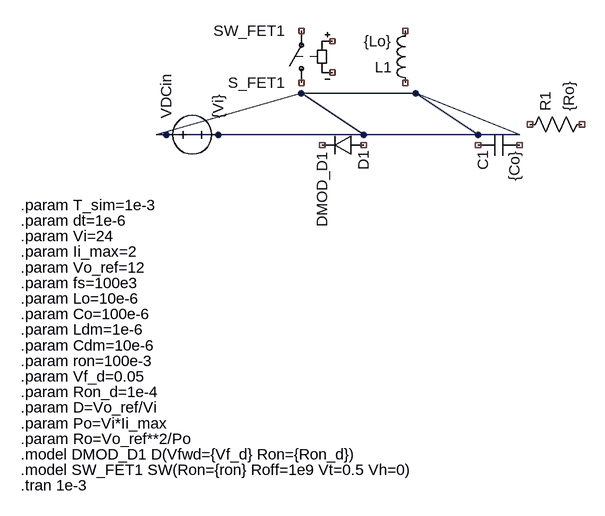
[diagram p0: schematic simple_buck_prb.asc]
simple_buck_prb.asc, the LTspice schematic file:
Version 4
SHEET 1 880 680
WIRE 400 128 576 128
WIRE 400 128 496 192
WIRE 176 192 400 128
WIRE 576 128 672 192
WIRE 576 128 736 192
WIRE 672 192 736 192
WIRE 672 192 176 192
WIRE 672 192 496 192
SYMBOL voltage 176 192 R270
SYMATTR InstName VDCin
SYMATTR Value {Vi}
SYMBOL res 736 192 R270
SYMATTR InstName R1
SYMATTR Value {Ro}
SYMBOL ind 576 128 R180
SYMATTR InstName L1
SYMATTR Value {Lo}
SYMATTR SpiceLine ic=0
SYMBOL cap 672 192 M90
SYMATTR InstName C1
SYMATTR Value {Co}
SYMATTR SpiceLine ic={Vo_ref}
SYMBOL diode 496 192 R90
SYMATTR InstName D1
SYMATTR Value DMOD_D1
SYMBOL sw 400 128 R180
SYMATTR InstName S_FET1
SYMATTR Value SW_FET1
TEXT -32 300 Left 2 !.param T_sim=1e-3
TEXT -32 324 Left 2 !.param dt=1e-6
TEXT -32 348 Left 2 !.param Vi=24
TEXT -32 372 Left 2 !.param Ii_max=2
TEXT -32 396 Left 2 !.param Vo_ref=12
TEXT -32 420 Left 2 !.param fs=100e3
TEXT -32 444 Left 2 !.param Lo=10e-6
TEXT -32 468 Left 2 !.param Co=100e-6
TEXT -32 492 Left 2 !.param Ldm=1e-6
TEXT -32 516 Left 2 !.param Cdm=10e-6
TEXT -32 540 Left 2 !.param ron=100e-3
TEXT -32 564 Left 2 !.param Vf_d=0.05
TEXT -32 588 Left 2 !.param Ron_d=1e-4
TEXT -32 612 Left 2 !.param D=Vo_ref/Vi
TEXT -32 636 Left 2 !.param Po=Vi*Ii_max
TEXT -32 660 Left 2 !.param Ro=Vo_ref**2/Po
TEXT -32 684 Left 2 !.model DMOD_D1 D(Vfwd={Vf_d} Ron={Ron_d})
TEXT -32 708 Left 2 !.model SW_FET1 SW(Ron={ron} Roff=1e9 Vt=0.5 Vh=0)
TEXT -32 732 Left 2 !.tran 1e-3

The netlist it stands for:
* simple_buck_prb.asc
VDCin N001 N001 {Vi}
R1 NC_01 NC_02 {Ro}
L1 NC_03 NC_04 {Lo} ic=0
C1 NC_05 NC_06 {Co} ic={Vo_ref}
D1 NC_07 NC_08 DMOD_D1
S_FET1 NC_09 NC_10 NC_11 NC_12 SW_FET1
.model D D
.lib standard.dio
.param T_sim=1e-3
.param dt=1e-6
.param Vi=24
.param Ii_max=2
.param Vo_ref=12
.param fs=100e3
.param Lo=10e-6
.param Co=100e-6
.param Ldm=1e-6
.param Cdm=10e-6
.param ron=100e-3
.param Vf_d=0.05
.param Ron_d=1e-4
.param D=Vo_ref/Vi
.param Po=Vi*Ii_max
.param Ro=Vo_ref**2/Po
.model DMOD_D1 D(Vfwd={Vf_d} Ron={Ron_d})
.model SW_FET1 SW(Ron={ron} Roff=1e9 Vt=0.5 Vh=0)
.tran 1e-3
.backanno
.end